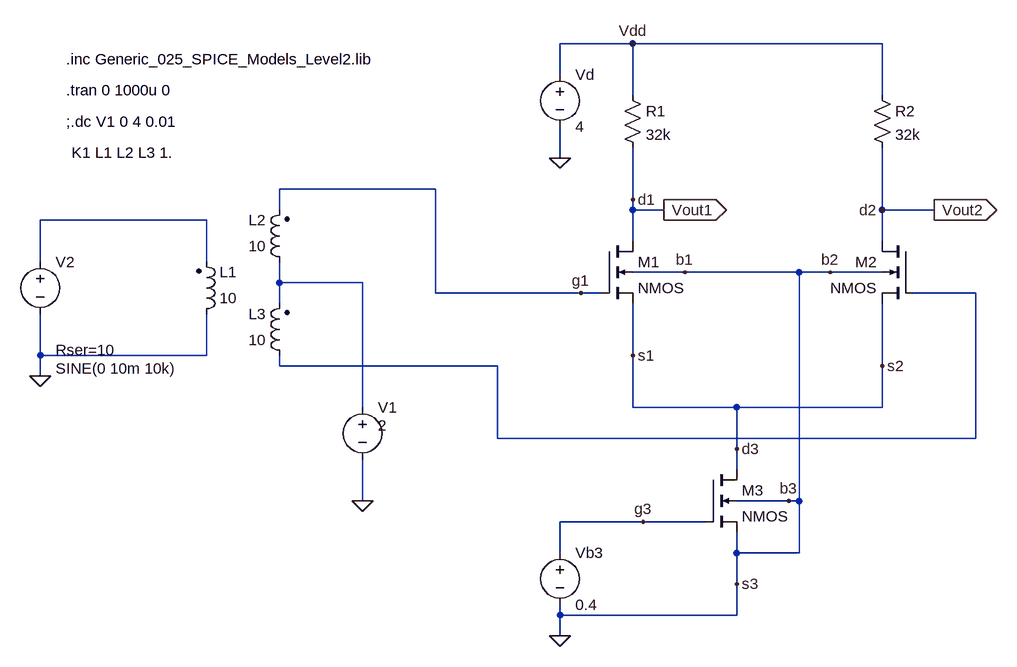
[diagram p0: schematic circuito_3.asc]
circuito_3.asc, the LTspice schematic file:
Version 4
SHEET 1 2972 712
WIRE 160 -240 48 -240
WIRE 544 -240 160 -240
WIRE 48 -192 48 -240
WIRE 160 -160 160 -240
WIRE 544 -160 544 -240
WIRE 48 -64 48 -112
WIRE -144 -16 -384 -16
WIRE 160 0 160 -80
WIRE -384 16 -384 -16
WIRE 160 16 160 0
WIRE 208 16 160 16
WIRE 544 16 544 -80
WIRE 624 16 544 16
WIRE -496 32 -752 32
WIRE 160 64 160 16
WIRE 544 64 544 16
WIRE -752 96 -752 32
WIRE -496 96 -496 32
WIRE 240 112 160 112
WIRE 416 112 240 112
WIRE 464 112 416 112
WIRE 544 112 464 112
WIRE -384 128 -384 96
WIRE -256 128 -384 128
WIRE -144 144 -144 -16
WIRE 80 144 -144 144
WIRE 112 144 80 144
WIRE 688 144 592 144
WIRE -384 160 -384 128
WIRE -752 240 -752 176
WIRE -496 240 -496 176
WIRE -496 240 -752 240
WIRE 160 240 160 160
WIRE -384 256 -384 240
WIRE -48 256 -384 256
WIRE 544 256 544 160
WIRE -752 272 -752 240
WIRE -256 320 -256 128
WIRE 160 320 160 240
WIRE 320 320 160 320
WIRE 544 320 544 256
WIRE 544 320 320 320
WIRE -48 368 -48 256
WIRE 688 368 688 144
WIRE 688 368 -48 368
WIRE 320 384 320 320
WIRE 320 416 320 384
WIRE -256 464 -256 400
WIRE 400 464 320 464
WIRE 416 464 416 112
WIRE 416 464 400 464
WIRE 176 496 48 496
WIRE 272 496 176 496
WIRE 48 544 48 496
WIRE 320 544 320 512
WIRE 416 544 416 464
WIRE 416 544 320 544
WIRE 320 592 320 544
WIRE 48 640 48 624
WIRE 320 640 320 592
WIRE 320 640 48 640
WIRE 48 672 48 640
FLAG 48 -64 0
FLAG 160 -240 Vdd
FLAG 240 112 b1
FLAG 80 144 g1
FLAG 160 0 d1
FLAG 160 240 s1
FLAG 208 16 Vout1
IOPIN 208 16 Out
FLAG 624 16 Vout2
IOPIN 624 16 Out
FLAG 544 256 s2
FLAG 464 112 b2
FLAG 544 16 d2
FLAG 176 496 g3
FLAG 320 384 d3
FLAG 48 672 0
FLAG 320 592 s3
FLAG 400 464 b3
FLAG -256 464 0
FLAG -752 272 0
SYMBOL voltage 48 -208 R0
WINDOW 123 0 0 Left 2
WINDOW 39 0 0 Left 2
SYMATTR InstName Vd
SYMATTR Value 4
SYMBOL res 144 -176 R0
SYMATTR InstName R1
SYMATTR Value 32k
SYMBOL nmos4 112 64 R0
SYMATTR InstName M1
SYMATTR Value2 l=1u w=27.658u
SYMBOL res 528 -176 R0
SYMATTR InstName R2
SYMATTR Value 32k
SYMBOL nmos4 592 64 M0
SYMATTR InstName M2
SYMATTR Value2 l=1u w=27.658u
SYMBOL nmos4 272 416 R0
SYMATTR InstName M3
SYMATTR Value2 l=1u w=70u
SYMBOL voltage 48 528 R0
WINDOW 123 0 0 Left 2
WINDOW 39 0 0 Left 2
SYMATTR InstName Vb3
SYMATTR Value 0.4
SYMBOL voltage -256 304 R0
WINDOW 123 0 0 Left 0
WINDOW 39 24 72 Left 2
WINDOW 3 24 44 Left 2
SYMATTR InstName V1
SYMATTR Value 2
SYMBOL voltage -752 80 R0
WINDOW 123 24 124 Left 2
WINDOW 39 24 152 Left 2
WINDOW 3 24 180 Left 2
SYMATTR SpiceLine Rser=10
SYMATTR InstName V2
SYMATTR Value SINE(0 10m 10k)
SYMBOL ind2 -512 192 M180
WINDOW 0 36 80 Left 2
WINDOW 3 36 40 Left 2
SYMATTR InstName L1
SYMATTR Value 10
SYMBOL ind2 -368 112 R180
WINDOW 0 36 80 Left 2
WINDOW 3 36 40 Left 2
SYMATTR InstName L2
SYMATTR Value 10
SYMBOL ind2 -368 256 R180
WINDOW 0 36 80 Left 2
WINDOW 3 36 40 Left 2
SYMATTR InstName L3
SYMATTR Value 10
TEXT -712 -216 Left 2 !.inc Generic_025_SPICE_Models_Level2.lib
TEXT -712 -120 Left 2 !;.dc V1 0 4 0.01
TEXT -704 -72 Left 2 !K1 L1 L2 L3 1.
TEXT -712 -168 Left 2 !.tran 0 1000u 0

The netlist it stands for:
* circuito_3.asc
Vd Vdd 0 4
R1 Vdd Vout1 32k
M1 Vout1 g1 d3 0 NMOS l=1u w=27.658u
R2 Vdd d2 32k
M2 d2 N003 d3 0 NMOS l=1u w=27.658u
M3 d3 g3 0 0 NMOS l=1u w=70u
Vb3 g3 0 0.4
V1 N002 0 2
V2 N001 0 SINE(0 10m 10k) Rser=10
L1 0 N001 10
L2 N002 g1 10
L3 N003 N002 10
.model NMOS NMOS
.model PMOS PMOS
.lib standard.mos
.inc Generic_025_SPICE_Models_Level2.lib
;.dc V1 0 4 0.01
K1 L1 L2 L3 1.
.tran 0 1000u 0
.backanno
.end